# EAGLE design ArdWifi (EAGLE 6.5.0)
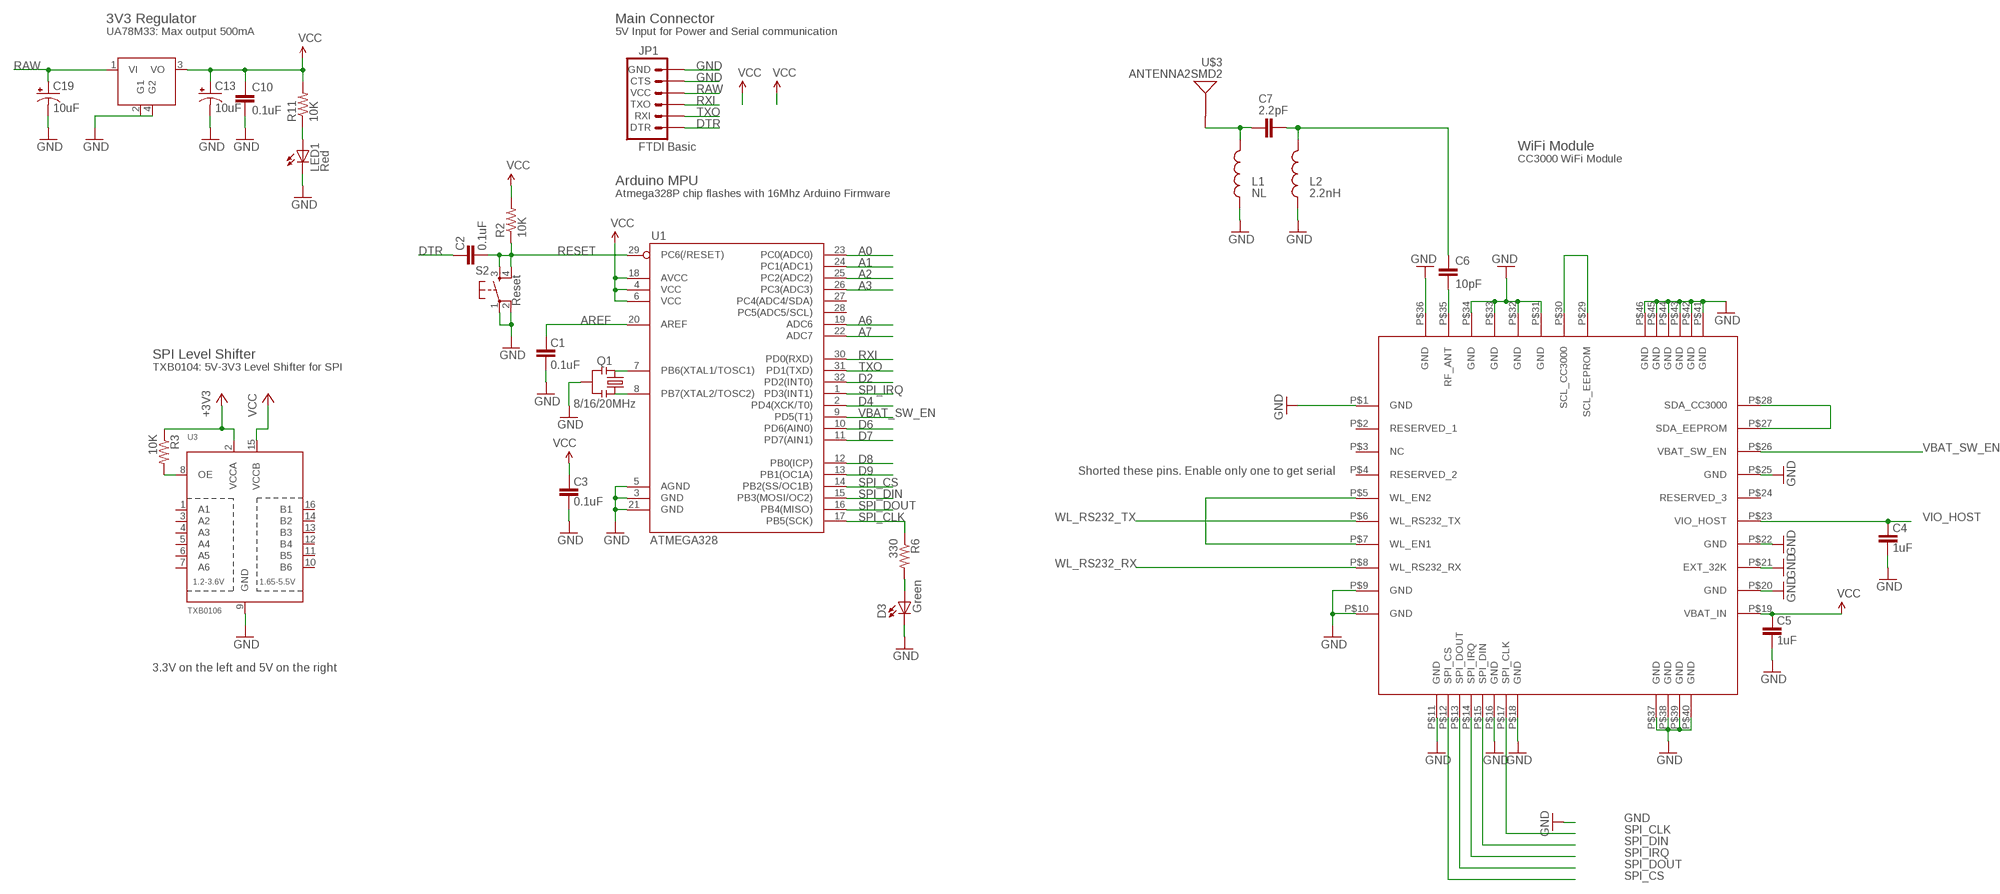
[diagram p0: schematic, sheet 1]

## Parts
C1  0.1uF  CAP0402-CAP  [0402-CAP]
C2  0.1uF  CAP0402-CAP  [0402-CAP]
C3  0.1uF  CAP0402-CAP  [0402-CAP]
C4  1uF  CAP0402-CAP  [0402-CAP]
C5  1uF  CAP0402-CAP  [0402-CAP]
C6  10pF  CAP0402-CAP  [0402-CAP]
C7  2.2pF  CAP0402-CAP  [0402-CAP]
C10  0.1uF  CAP0402-CAP  [0402-CAP]
C13  10uF  CAP_POL1206  [EIA3216]
C19  10uF  CAP_POL1206  [EIA3216]
D3  Green  LED0603  [LED-0603]
JP1  FTDI Basic  ARDUINO_SERIAL_PROGRAMPTH  [1X06]
L1  NL  INDUCTOR0402  [C0402]
L2  2.2nH  INDUCTOR0402  [C0402]
LED1  Red  LED0603  [LED-0603]
Q1  8/16/20MHz  RESONATORSMD  [RESONATOR-SMD]
R2  10K  RESISTOR0402-RES  [0402-RES]
R3  10K  R-US_R0603  [R0603]
R6  330  RESISTOR0402-RES  [0402-RES]
R11  10K  RESISTOR0402-RES  [0402-RES]
REG1  LDO_UA78M33  [SOT223]
S2  Reset  TAC_SWITCHSMD  [TACTILE_SWITCH_SMD]
U1  ATMEGA328  ATMEGA168  [TQFP32-08]
U3  TXB0106  TXB0106PWR  [TSSOP16]
U$1  CC3000  [CC3000]
U$3  ANTENNA2SMD2  [ANTENNA-CHIP3]

## Nets
+3V3: R3.1 U3.2(VCCA)
A0: U1.23(PC0(ADC0))
A1: U1.24(PC1(ADC1))
A2: U1.25(PC2(ADC2))
A3: U1.26(PC3(ADC3))
A6: U1.19(ADC6)
A7: U1.22(ADC7)
AREF: C1.2 U1.20(AREF)
D2: U1.32(PD2(INT0))
D4: U1.2(PD4(XCK/T0))
D6: U1.10(PD6(AIN0))
D7: U1.11(PD7(AIN1))
D8: U1.12(PB0(ICP))
D9: U1.13(PB1(OC1A))
DTR: C2.2 JP1.1(DTR)
GND [vcc]: C1.1 C3.1 C4.1 C5.1 C10.2 C13.C(-) C19.C(-) D3.C JP1.5(CTS) JP1.6(GND) L1.1 L2.1 LED1.C Q1.2 REG1.2(G1) REG1.4(G2) S2.1 S2.2 U1.3(GND) U1.5(AGND) U1.21(GND) U3.9(GND) U$1.P$1(GND) U$1.P$9(GND) U$1.P$10(GND) U$1.P$11(GND) U$1.P$16(GND) U$1.P$18(GND) U$1.P$20(GND) U$1.P$21(EXT_32K) U$1.P$22(GND) U$1.P$25(GND) U$1.P$31(GND) U$1.P$32(GND) U$1.P$33(GND) U$1.P$34(GND) U$1.P$36(GND) U$1.P$37(GND) U$1.P$38(GND) U$1.P$39(GND) U$1.P$40(GND) U$1.P$41(GND) U$1.P$42(GND) U$1.P$43(GND) U$1.P$44(GND) U$1.P$45(GND) U$1.P$46(GND)
N$1: Q1.1 U1.8(PB7(XTAL2/TOSC2))
N$2: Q1.3 U1.7(PB6(XTAL1/TOSC1))
N$7: D3.A R6.2
N$10: C6.1 C7.2 L2.2
N$13: C6.2 U$1.P$35(RF_ANT)
N$15: C7.1 L1.2 U$3.FEED(SIGNAL)
N$16: U$1.P$29(SCL_EEPROM) U$1.P$30(SCL_CC3000)
N$18: U$1.P$27(SDA_EEPROM) U$1.P$28(SDA_CC3000)
N$38: LED1.A R11.1
N$114: R3.2 U3.8(OE)
RAW [vcc]: C19.A(+) JP1.4(VCC) REG1.1(VI)
RESET: C2.1 R2.1 S2.3 S2.4 U1.29(PC6(/RESET))
RXI: JP1.3(TXO) U1.30(PD0(RXD))
SPI_CLK: R6.1 U1.17(PB5(SCK)) U$1.P$17(SPI_CLK)
SPI_CS: U1.14(PB2(SS/OC1B)) U$1.P$12(SPI_CS)
SPI_DIN: U1.15(PB3(MOSI/OC2)) U$1.P$15(SPI_DIN)
SPI_DOUT: U1.16(PB4(MISO)) U$1.P$13(SPI_DOUT)
SPI_IRQ: U1.1(PD3(INT1)) U$1.P$14(SPI_IRQ)
TXO: JP1.2(RXI) U1.31(PD1(TXD))
VBAT_SW_EN: U1.9(PD5(T1)) U$1.P$26(VBAT_SW_EN)
VCC: C3.2 C5.2 C10.1 C13.A(+) R2.2 R11.2 REG1.3(VO) U1.4(VCC) U1.6(VCC) U1.18(AVCC) U3.15(VCCB) U$1.P$19(VBAT_IN)
VIO_HOST: C4.2 U$1.P$23(VIO_HOST)
WL_EN2: U$1.P$5(WL_EN2) U$1.P$7(WL_EN1)
WL_RS232_RX: U$1.P$8(WL_RS232_RX)
WL_RS232_TX: U$1.P$6(WL_RS232_TX)
Unconnected: U1.27(PC4(ADC4/SDA)) U1.28(PC5(ADC5/SCL)) U3.1(A1) U3.3(A2) U3.4(A3) U3.5(A4) U3.6(A5) U3.7(A6) U3.10(B6) U3.11(B5) U3.12(B4) U3.13(B3) U3.14(B2) U3.16(B1) U$1.P$2(RESERVED_1) U$1.P$3(NC) U$1.P$4(RESERVED_2) U$1.P$24(RESERVED_3)

## Notes on the sheet
- 3V3 Regulator | Main Connector
- UA78M33: Max output 500mA | 5V Input for Power and Serial communication
- WiFi Module
- CC3000 WiFi Module
- Arduino MPU
- Atmega328P chip flashes with 16Mhz Arduino Firmware
- SPI Level Shifter
- TXB0104: 5V-3V3 Level Shifter for SPI
- Shorted these pins. Enable only one to get serial
- 3.3V on the left and 5V on the right

## Library data of the parts
C1-C7 C10 = SparkFun:CAP: Capacitor Standard 0603 ceramic capacitor, and 0.1" leaded capacitor.
C13 C19 = SparkFun:CAP_POL: Capacitor Polarized These are standard SMD and PTH capacitors. Normally 10uF, 47uF, and 100uF in electrolytic and tantalum varieties. Always verify the external diameter of the through hole cap, it varies with capacity, voltage, and manufacturer. The EIA devices should be standard.
D3 LED1 = SparkFun:LED: LEDs Standard schematic elements and footprints for 5mm, 3mm, 1206, and 0603 sized LEDs. 5mm - Spark Fun Electronics SKU : COM-00529 (and others)
JP1 = SparkFun:ARDUINO_SERIAL_PROGRAM
L1 L2 = SparkFun:INDUCTOR: Inductors Basic Inductor/Choke - 0603 and 1206. Footprints are not proven and vary greatly between part numbers.
Q1 = SparkFun:RESONATOR: Resonator Small SMD resonator. This is the itty bitty 10/20MHz resonators with built in caps. CSTCE10M0G55 and CSTCE20M0V53. Footprint has been reviewed closely but hasn't been tested yet.
R2 R6 R11 = SparkFun:RESISTOR: Resistor Basic schematic elements and footprints for 0603, 1206, and PTH resistors.
R3 = resistor:R-US_: RESISTOR, American symbol
REG1 = carrilib:LDO_UA78M33: 500MA 3.3V Regulator Manufacturer: TI Part Number: UA78M33
S2 = SparkFun:TAC_SWITCH: Momentary Switch Button commonly used for reset or general input. Spark Fun Electronics SKU : COM-00097
U1 = SparkFun:ATMEGA168
U3 = McLEng:TXB0106PWR: 6-Bit Bi-Directional Level Shifter 1.2V-3.6V (VCCA) to 1.65V-5.5V (VCCB) bi-directional level shifter with auto direction sensing. Max data rate - VCCA 1.8V: 20Mbps (50ns), VCCA 3.3V: 100Mbps (10ns) Digikey: 296-23759-1-ND
U$1 = centerblack_engineering:CC3000: TI SimpleLink CC3000 Module - WiFi 802.11b/g Network Processor; AUTHOR: Matt Bigarani; DATASHEET: http://www.ti.com/lit/ds/symlink/cc3000.pdf; DATE: 2/8/2013
U$3 = SparkFun:ANTENNA2: Antenna Single endded antenna. Common with smaller chip antennas. CHIP4 package is the GPS Chip Antenna SKU: GPS-08418. CHIP5 package is 2.4GHz chip antenna SKU: WRL-00144.

## Net classes
0 default: width 0.203 mm
1 vcc: width 0.254 mm

## Board
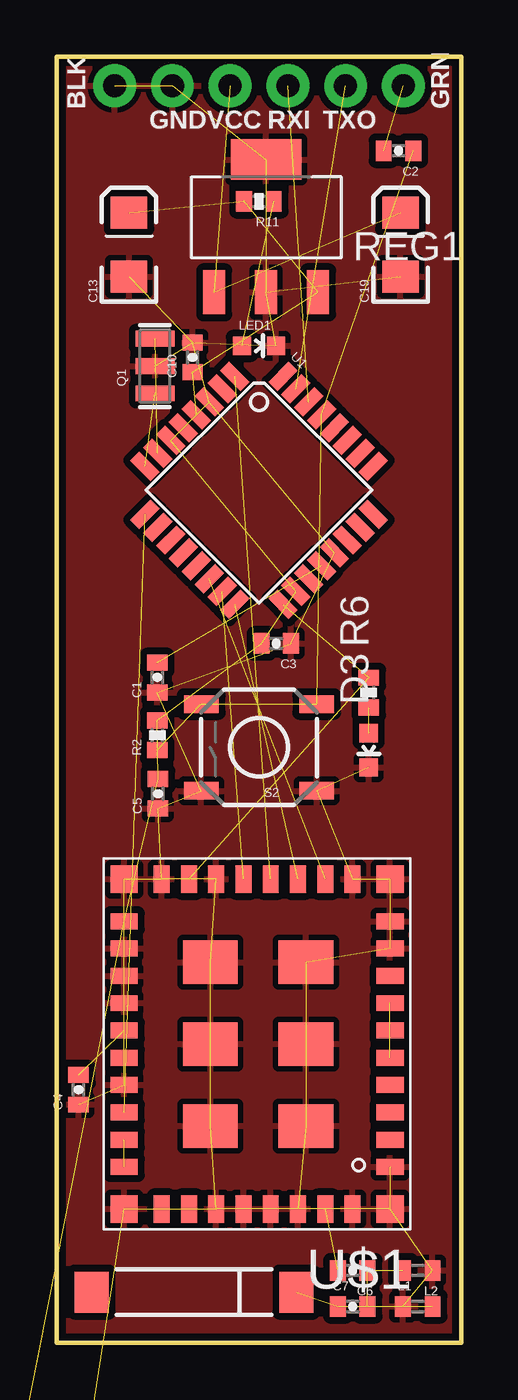
[diagram p1: board, top side]
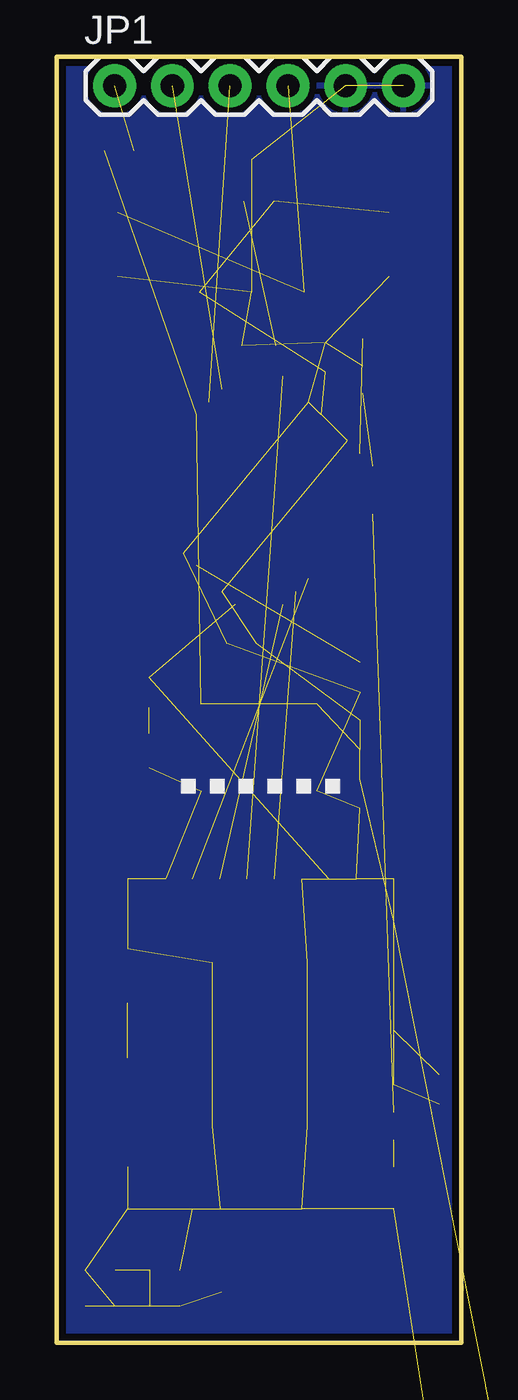
[diagram p2: board, bottom side, seen from below]

Size 17.78 x 56.52 mm. Coordinates in mm from the lower left corner, seen from the top.
Outline: 0,56.52 0,0 17.78,0 17.78,56.52 0,56.52
Copper layers (1*16): Top 0.035mm / dielectric 1.5mm / Bottom 0.035mm
Design rules "default": minimum track width 8mil, minimum drill 20mil, track to track 8mil, track to pad 8mil, pad to pad 8mil, via to via 8mil, smd to smd 8mil, copper to edge 8mil, drill to drill 8mil, minimum pad ring 12mil, minimum via ring 10mil, stop-mask expansion 4mil, vias tented up to drill 20mil, thermal gap 10mil

### Footprints (pad centres in the part's own frame; a part is rotated, then mirrored left to right if it is on the bottom)
0402-CAP = smd 0.7 x 0.9: 1 -0.65,0; 2 0.65,0
EIA3216 = smd 1.4 x 1.6: A 1.4,0; C -1.4,0
LED-0603 = smd 0.8 x 0.8: A 0,-0.75; C 0,0.75
1X06 = drill 1.016 pad 1.88: 1 0,0; 2 2.54,0; 3 5.08,0; 4 7.62,0; 5 10.16,0; 6 12.7,0
C0402 = smd 0.7 x 0.9: 1 -0.65,0; 2 0.65,0
RESONATOR-SMD = smd 0.7 x 1.7: 1 -1.2,0; 2 0,0; 3 1.2,0
0402-RES = smd 0.7 x 0.9: 1 -0.65,0; 2 0.65,0
R0603 = smd 1 x 1.1: 1 -0.85,0; 2 0.85,0
SOT223 = smd 0.965 x 1.93: 1 -2.286,-3.048; 2 0,-3.048; 3 2.286,-3.048 | smd 3.099 x 1.778: 4 0,2.794
TACTILE_SWITCH_SMD = smd 1.524 x 0.762: 1 -2.54,1.905; 2 2.54,1.905; 3 -2.54,-1.905; 4 2.54,-1.905
TQFP32-08 = smd 1.27 x 0.559: 1 -4.293,2.8; 2 -4.293,2; 3 -4.293,1.2; 4 -4.293,0.4; 5 -4.293,-0.4; 6 -4.293,-1.2; 7 -4.293,-2; 8 -4.293,-2.8; 17 4.293,-2.8; 18 4.293,-2; 19 4.293,-1.2; 20 4.293,-0.4; 21 4.293,0.4; 22 4.293,1.2; 23 4.293,2; 24 4.293,2.8 | smd 0.559 x 1.27: 9 -2.8,-4.293; 10 -2,-4.293; 11 -1.2,-4.293; 12 -0.4,-4.293; 13 0.4,-4.293; 14 1.2,-4.293; 15 2,-4.293; 16 2.8,-4.293; 25 2.8,4.293; 26 2,4.293; 27 1.2,4.293; 28 0.4,4.293; 29 -0.4,4.293; 30 -1.2,4.293; 31 -2,4.293; 32 -2.8,4.293
TSSOP16 = smd 0.35 x 1.6: 1 -2.275,-2.8; 2 -1.625,-2.8; 3 -0.975,-2.8; 4 -0.325,-2.8; 5 0.325,-2.8; 6 0.975,-2.8; 7 1.625,-2.8; 8 2.275,-2.8; 9 2.275,2.8; 10 1.625,2.8; 11 0.975,2.8; 12 0.325,2.8; 13 -0.325,2.8; 14 -0.975,2.8; 15 -1.625,2.8; 16 -2.275,2.8
CC3000 = smd 1.2 x 0.7: P$1 0.9,13.55; P$2 0.9,12.35; P$3 0.9,11.15; P$4 0.9,9.95; P$5 0.9,8.75; P$6 0.9,7.55; P$7 0.9,6.35; P$8 0.9,5.15; P$9 0.9,3.95; P$10 0.9,2.75; P$19 12.6,2.75; P$20 12.6,3.95; P$21 12.6,5.15; P$22 12.6,6.35; P$23 12.6,7.55; P$24 12.6,8.75; P$25 12.6,9.95; P$26 12.6,11.15; P$27 12.6,12.35; P$28 12.6,13.55 | smd 0.7 x 1.2: P$11 2.55,0.9; P$12 3.75,0.9; P$13 4.95,0.9; P$14 6.15,0.9; P$15 7.35,0.9; P$16 8.55,0.9; P$17 9.75,0.9; P$18 10.95,0.9; P$29 10.95,15.4; P$30 9.75,15.4; P$31 8.55,15.4; P$32 7.35,15.4; P$33 6.15,15.4; P$34 4.95,15.4; P$35 3.75,15.4; P$36 2.55,15.4 | smd 2.4 x 1.9: P$37 4.6,11.75; P$38 4.6,8.15; P$39 4.6,4.55; P$40 8.8,11.75; P$41 8.8,8.15; P$42 8.8,4.55 | smd 1.2 x 1.2: P$43 0.9,15.4; P$44 0.9,0.9; P$45 12.6,0.9; P$46 12.6,15.4
ANTENNA-CHIP3 = smd 1.8 x 1.5: FEED 0,4.5; NC 0,-4.5

### Placement (x,y rotation side)
C1  4.42,29.24 90 top
C2  15.02,52.39 180 top
C3  9.65,30.73 180 top
C4  0.95,11.11 90 top
C5  4.45,24.13 90 top
C6  13.02,3.17 180 top
C7  13.02,1.59 0 top
C10  5.97,43.31 90 top
C13  3.18,48.26 90 top
C19  15.11,48.26 90 top
D3  13.72,26.03 180 top
JP1  15.24,55.24 0 bottom
L1  15.87,1.59 0 top
L2  15.87,3.17 180 top
LED1  8.89,43.81 270 top
Q1  4.32,42.93 90 top
R2  4.42,26.7 90 top
R3  -7.3,-36.2 0 top  (outside the outline)
R6  13.72,28.58 270 top
R11  8.89,50.16 180 top
REG1  9.21,49.21 0 top
S2  8.89,26.16 180 top
U1  8.89,37.46 315 top
U3  -4.45,-29.84 0 top  (outside the outline)
U$1  15.56,21.27 180 top
U$3  6.03,2.22 270 top

### Tracks (layer width: path | path; a pad name or v marks a point on that pad's centre or on a via)
+3V3  (1 unrouted)
AREF  (1 unrouted)
DTR  (1 unrouted)
GND  (46 unrouted)
  pour Top (isolate 0.305): 0,56.52 17.78,56.52 17.78,0 0,0
  pour Bottom (isolate 0.305): 0,56.52 17.78,56.52 17.78,0 0,0
N$1  (1 unrouted)
N$2  (1 unrouted)
N$7  (1 unrouted)
N$10  (2 unrouted)
N$13  (1 unrouted)
N$15  (2 unrouted)
N$16  (1 unrouted)
N$18  (1 unrouted)
N$38  (1 unrouted)
N$114  (1 unrouted)
RAW  (2 unrouted)
RESET  (4 unrouted)
RXI  (1 unrouted)
SPI_CLK  (2 unrouted)
SPI_CS  (1 unrouted)
SPI_DIN  (1 unrouted)
SPI_DOUT  (1 unrouted)
SPI_IRQ  (1 unrouted)
TXO  (1 unrouted)
VBAT_SW_EN  (1 unrouted)
VCC  (11 unrouted)
VIO_HOST  (1 unrouted)
WL_EN2  (1 unrouted)

### Text on the board
tPlace: BLK | GRN | GND | VCC | RXI | TXO
tValues: Valid combinations: | 168V / 3.3V Reg / 8MHz | 168 / 5V Reg / 16MHz | 168 / 5V Reg / 20MHz | Mark back accordingly | Arduino Pro Mini